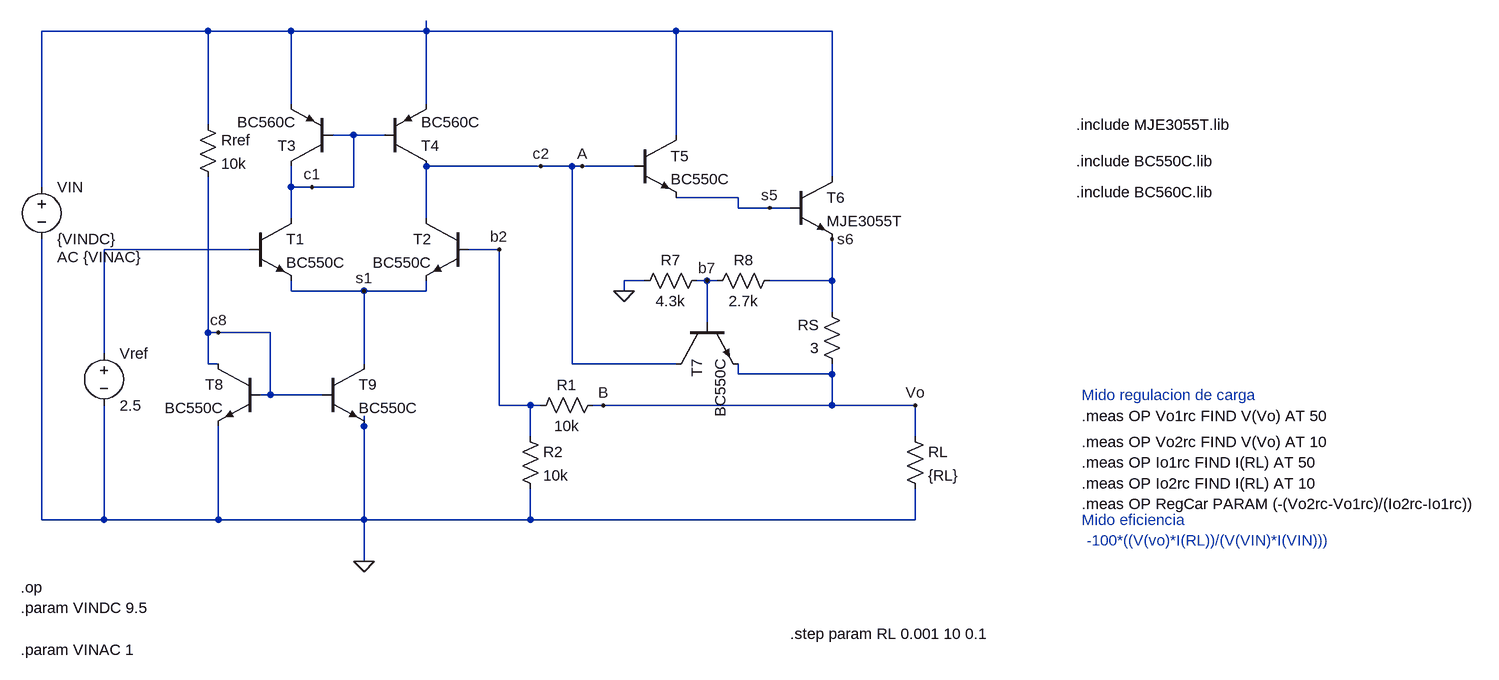
[diagram p0: schematic sim lazo corriente.asc]
sim lazo corriente.asc, the LTspice schematic file:
Version 4.1
SHEET 1 2036 912
WIRE 32 -176 -224 -176
WIRE 160 -176 32 -176
WIRE 368 -176 368 -192
WIRE 368 -176 160 -176
WIRE 752 -176 368 -176
WIRE 992 -176 752 -176
WIRE 160 -64 160 -176
WIRE 368 -64 368 -176
WIRE 32 -32 32 -176
WIRE 256 -16 224 -16
WIRE 304 -16 256 -16
WIRE 752 -16 752 -176
WIRE 544 32 368 32
WIRE 592 32 544 32
WIRE 608 32 592 32
WIRE 688 32 608 32
WIRE 992 48 992 -176
WIRE -224 64 -224 -176
WIRE 160 64 160 32
WIRE 192 64 160 64
WIRE 256 64 256 -16
WIRE 256 64 192 64
WIRE 848 80 752 80
WIRE 848 96 848 80
WIRE 896 96 848 96
WIRE 928 96 896 96
WIRE 160 112 160 64
WIRE 368 112 368 32
WIRE 96 160 -128 160
WIRE 480 160 432 160
WIRE 704 208 672 208
WIRE 800 208 784 208
WIRE 816 208 800 208
WIRE 992 208 992 144
WIRE 992 208 896 208
WIRE 160 224 160 208
WIRE 272 224 160 224
WIRE 368 224 368 208
WIRE 368 224 272 224
WIRE 672 224 672 208
WIRE 992 256 992 208
WIRE 800 272 800 208
WIRE 32 288 32 48
WIRE 48 288 32 288
WIRE 128 288 48 288
WIRE -128 320 -128 160
WIRE 32 336 32 288
WIRE 48 336 32 336
WIRE 272 336 272 224
WIRE 592 336 592 32
WIRE 752 336 592 336
WIRE 848 352 848 336
WIRE 992 352 992 336
WIRE 992 352 848 352
WIRE 128 384 128 288
WIRE 128 384 112 384
WIRE 208 384 128 384
WIRE 480 400 480 160
WIRE 528 400 480 400
WIRE 544 400 528 400
WIRE 640 400 624 400
WIRE 992 400 992 352
WIRE 992 400 640 400
WIRE 1120 400 992 400
WIRE 272 432 272 416
WIRE 528 448 528 400
WIRE 1120 448 1120 400
WIRE -224 576 -224 144
WIRE -128 576 -128 400
WIRE -128 576 -224 576
WIRE 48 576 48 432
WIRE 48 576 -128 576
WIRE 272 576 272 432
WIRE 272 576 48 576
WIRE 528 576 528 528
WIRE 528 576 272 576
WIRE 1120 576 1120 528
WIRE 1120 576 528 576
WIRE 272 640 272 576
FLAG 672 224 0
FLAG 272 640 0
FLAG 1120 400 Vo
FLAG 608 32 A
FLAG 640 400 B
FLAG 48 288 c8
FLAG 272 224 s1
FLAG 192 64 c1
FLAG 544 32 c2
FLAG 800 208 b7
FLAG 992 144 s6
FLAG 896 96 s5
FLAG 480 160 b2
DATAFLAG 992 400 ""
DATAFLAG 992 400 ""
DATAFLAG 480 224 ""
DATAFLAG 368 -96 ""
DATAFLAG 160 -112 ""
DATAFLAG 32 96 ""
DATAFLAG 48 512 ""
DATAFLAG 176 384 ""
DATAFLAG 384 32 ""
DATAFLAG 160 64 ""
DATAFLAG 848 96 ""
DATAFLAG 992 192 ""
DATAFLAG 160 224 ""
DATAFLAG 608 16 ""
DATAFLAG 1104 400 ""
DATAFLAG 1120 400 ""
SYMBOL npn 96 112 R0
SYMATTR InstName T1
SYMATTR Value BC550C
SYMBOL npn 432 112 M0
SYMATTR InstName T2
SYMATTR Value BC550C
SYMBOL npn 688 -16 R0
SYMATTR InstName T5
SYMATTR Value BC550C
SYMBOL npn 928 48 R0
SYMATTR InstName T6
SYMATTR Value MJE3055T
SYMBOL npn 752 272 M90
SYMATTR InstName T7
SYMATTR Value BC550C
SYMBOL res 1008 352 R180
WINDOW 0 36 76 Left 2
WINDOW 3 36 40 Left 2
SYMATTR InstName RS
SYMATTR Value 3
SYMBOL res 1104 432 R0
SYMATTR InstName RL
SYMATTR Value {RL}
SYMBOL res 512 432 R0
SYMATTR InstName R2
SYMATTR Value 10k
SYMBOL res 640 384 R90
WINDOW 0 0 56 VBottom 2
WINDOW 3 32 56 VTop 2
SYMATTR InstName R1
SYMATTR Value 10k
SYMBOL res 800 192 R90
WINDOW 0 0 56 VBottom 2
WINDOW 3 32 56 VTop 2
SYMATTR InstName R7
SYMATTR Value 4.3k
SYMBOL res 912 192 R90
WINDOW 0 0 56 VBottom 2
WINDOW 3 32 56 VTop 2
SYMATTR InstName R8
SYMATTR Value 2.7k
SYMBOL voltage -224 48 R0
WINDOW 123 24 124 Left 2
WINDOW 39 0 0 Left 0
SYMATTR Value2 AC {VINAC}
SYMATTR InstName VIN
SYMATTR Value {VINDC}
SYMBOL pnp 224 32 R180
SYMATTR InstName T3
SYMATTR Value BC560C
SYMBOL pnp 304 32 M180
SYMATTR InstName T4
SYMATTR Value BC560C
SYMBOL voltage -128 304 R0
WINDOW 123 0 0 Left 0
WINDOW 39 0 0 Left 0
SYMATTR InstName Vref
SYMATTR Value 2.5
SYMBOL npn 208 336 R0
SYMATTR InstName T9
SYMATTR Value BC550C
SYMBOL npn 112 336 M0
SYMATTR InstName T8
SYMATTR Value BC550C
SYMBOL res 16 -48 R0
SYMATTR InstName Rref
SYMATTR Value 10k
TEXT 1368 24 Left 2 !.include BC550C.lib
TEXT 1368 72 Left 2 !.include BC560C.lib
TEXT -256 712 Left 2 !.param VINDC 9.5
TEXT -256 776 Left 2 !.param VINAC 1
TEXT 928 752 Left 2 !.step param RL 0.001 10 0.1
TEXT 1376 384 Left 2 ;Mido regulacion de carga
TEXT 1376 576 Left 2 ;Mido eficiencia
TEXT 1376 416 Left 2 !.meas OP Vo1rc FIND V(Vo) AT 50
TEXT 1376 456 Left 2 !.meas OP Vo2rc FIND V(Vo) AT 10
TEXT 1376 488 Left 2 !.meas OP Io1rc FIND I(RL) AT 50
TEXT 1376 520 Left 2 !.meas OP Io2rc FIND I(RL) AT 10
TEXT 1376 552 Left 2 !.meas OP RegCar PARAM (-(Vo2rc-Vo1rc)/(Io2rc-Io1rc))
TEXT 1384 608 Left 2 ;-100*((V(vo)*I(RL))/(V(VIN)*I(VIN)))
TEXT 1368 -32 Left 2 !.include MJE3055T.lib
TEXT -256 680 Left 2 !.op

The netlist it stands for:
* sim lazo corriente.asc
Q§T1 c1 N002 s1 0 BC550C
Q§T2 c2 b2 s1 0 BC550C
Q§T5 N001 c2 s5 0 BC550C
Q§T6 N001 s5 s6 0 MJE3055T
Q§T7 c2 b7 B 0 BC550C
RS B s6 3
RL B 0 {RL}
R2 b2 0 10k
R1 B b2 10k
R7 b7 0 4.3k
R8 s6 b7 2.7k
VIN N001 0 {VINDC} AC {VINAC}
Q§T3 c1 c1 N001 0 BC560C
Q§T4 c2 c1 N001 0 BC560C
Vref N002 0 2.5
Q§T9 s1 c8 0 0 BC550C
Q§T8 c8 c8 0 0 BC550C
Rref N001 c8 10k
.model NPN NPN
.model PNP PNP
.lib standard.bjt
.include BC550C.lib
.include BC560C.lib
.param VINDC 9.5
.param VINAC 1
.step param RL 0.001 10 0.1
* Mido regulacion de carga
* Mido eficiencia
.meas OP Vo1rc FIND V(Vo) AT 50
.meas OP Vo2rc FIND V(Vo) AT 10
.meas OP Io1rc FIND I(RL) AT 50
.meas OP Io2rc FIND I(RL) AT 10
.meas OP RegCar PARAM (-(Vo2rc-Vo1rc)/(Io2rc-Io1rc))
* -100*((V(vo)*I(RL))/(V(VIN)*I(VIN)))
.include MJE3055T.lib
.op
.backanno
.end